# Altium schematic sheet LEDs.SchDoc
size A4; SheetNumber: 3; SheetTotal: 11; SPICEModelCachePAYDFKMG: <root> / <DocumentId>PAYDFKMG</DocumentId> / <CacheFrame Number="0"> / <Model Name="0603_150060bs75000" Kind="CKT"> / <Text>****** / .subckt 0603_150060BS75000  1  2 / D1 1 2 SMCW / .MODEL SMCW D / + IS=316.72E-15 / + N=3.9746 / + RS=1.2476 / + IKF=130.15E-6 / + CJO=1.0000E-12 / + M=.3333 / + VJ=.75 / + BV=5 / + IBV=10.00E-6 / + TT=5.0000E-9 / .ends</Text> / </Model> / <Model Name="0603_150060ys75000" Kind="CKT"> / <Text>****** / .subckt 0603_150060YS75000  1  2 / D1 1 2 SMCW / .MODEL SMCW D / + IS=10.010E-21 / + N=1.8441 / + RS=1.0000E-6 / + IKF=1.0000E3 / + CJO=1.0000E-12 / + M=.3333 / + VJ=.75 / + BV=5 / + IBV=10.00E-6 / + TT=5.0000E-9 / .ends</Text> / </Model> / <Model Name="0603_150060as75000" Kind="CKT"> / <Text>************************************************** / * Manufacturer:           Wurth Elektronik / * Kinds:                  SMT Mono-color Chip LED Waterclear / * Matchcode:              WL-SMCW / * Library Type:           LTspice / * Version:                rev22a / * Created/modified by:    Ella / * Date and Time:          2022-02-18 / * Team:                   eiSos EDA Service / * Contact:                libraries@we-online.com / ************************************************** / * Copyright(C) 2022 WÃ¼rth Elektronik eiSos GmbH &amp; Co. KG / * All Rights Reserved. / ************************************************** / * Disclaimer: While WÃ¼rth Elektronik eiSos has made every reasonable effort to ensure the accuracy / * of the simulation models provided, WÃ¼rth Elektronik eiSos does not guarantee the exemption of error on / * the simulation models, nor does WÃ¼rth Elektronik eiSos guarantee that the simulation model is current. / * WÃ¼rth Elektronik eiSos reserves the right to make any adjustments at any time without notice. / * WÃ¼rth Elektronik eiSos expressly disclaims all implied warranties regarding this simulation model. / ************************************************** / .subckt 0603_150060AS75000  1  2 / D1 1 2 SMCW / .MODEL SMCW D / + IS=10.010E-21 / + N=1.8643 / + RS=1.0000E-6 / + IKF=999 / + CJO=1.0000E-12 / + M=.3333 / + VJ=.75 / + BV=100 / + TT=5.0000E-9 / .ends</Text> / </Model> / <Model Name="0603_150060rs75000" Kind="CKT"> / <Text>****** / .subckt 0603_150060RS75000  1  2 / D1 1 2 SMCW / .MODEL SMCW D / + IS=39.260E-18 / + N=2.2264 / + RS=1.0000E-6 / + IKF=.13281 / + CJO=1.0000E-12 / + M=.3333 / + VJ=.75 / + BV=100 / + IBV=10.00E-6 / + TT=5.0000E-9 / .ends</Text> / </Model> / </CacheFrame> / </root>
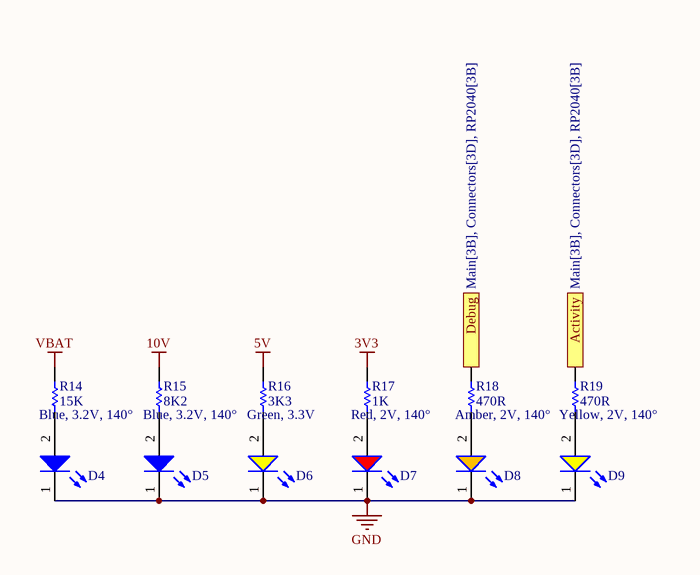
[diagram p0: LEDs.SchDoc]

## Parts
D4  Blue, 3.2V, 140°  [WL-SMCW_0603_150060xx75000]
D5  Blue, 3.2V, 140°  [WL-SMCW_0603_150060xx75000]
D6  Green, 3.3V  [WL-SMCW_0603_150060xx75000]
D7  Red, 2V, 140°  [WL-SMCW_0603_150060xx75000]
D8  Amber, 2V, 140°  [WL-SMCW_0603_150060xx75000]
D9  Yellow, 2V, 140°  [WL-SMCW_0603_150060xx75000]
R14  15K  [0402 resistor]
R15  8K2  [0402 resistor]
R16  3K3  [0402 resistor]
R17  1K  [0402 resistor]
R18  470R  [0402 resistor]
R19  470R  [0402 resistor]

## Ports
Activity (see Main[3B], Connectors[3D], RP2040[3B]), Debug (see Main[3B], Connectors[3D], RP2040[3B])

## Nets
3V3: R17.2
5V: R16.2
10V: R15.2
GND: D4.1(K) D5.1(K) D6.1(K) D7.1(K) D8.1(K) D9.1(K)
VBAT: R14.2
Activity: R19.2 ; port Activity
Debug: R18.2 ; port Debug
NetD4_2: D4.2(A) R14.1
NetD5_2: D5.2(A) R15.1
NetD6_2: D6.2(A) R16.1
NetD7_2: D7.2(A) R17.1
NetD8_2: D8.2(A) R18.1
NetD9_2: D9.2(A) R19.1

## Library data of the parts
D4 D5 = 150060BS75000: WL-SMCW Mono-color Chip LED Waterclear, size 0603, Blue, 3.2V, 140°; Manufacturer: Wurth Elektronik; Case/Size Code: 0603; Chip Technology: InGaN; Dominant Wavelength: 470nm; Luminous Intensity: 145mcd; Peak Wavelength: 465nm; Manufacturer Part Number: 150060BS75000; Category: Signal LEDs; Match Code: WL-SMCW; ComponentLink1Description: Website Link; ComponentLink1URL: https://www.we-online.com/redexpert/article/150060BS75000?ad; ComponentLink2Description: Datasheet Link; ComponentLink2URL: https://www.we-online.com/redexpert/spec/150060BS75000?ad; Mount: Surface Mount; Operating Temperature Max: 85°C; Operating Temperature Min: -40°C; Packaging: Tape and Reel; Length: 1.6mm; Width: 0.8mm; Height: 0.7mm; Emitting Color: Blue; Forward Voltage: 3.2V; Viewing Angle: 140°
D6 D9 = 150060YS75000: WL-SMCW Mono-color Chip LED Waterclear, size 0603, Yellow, 2V, 140°; Manufacturer: Wurth Elektronik; Case/Size Code: 0603; Chip Technology: AlInGaP; Dominant Wavelength: 590nm; Luminous Intensity: 120mcd; Peak Wavelength: 595nm; Manufacturer Part Number: 150060YS75000; Category: Signal LEDs; Match Code: WL-SMCW; ComponentLink1Description: Website Link; ComponentLink1URL: https://www.we-online.com/redexpert/article/150060YS75000?ad; ComponentLink2Description: Datasheet Link; ComponentLink2URL: https://www.we-online.com/redexpert/spec/150060YS75000?ad; Mount: Surface Mount; Operating Temperature Max: 85°C; Operating Temperature Min: -40°C; Packaging: Tape and Reel; Length: 1.6mm; Width: 0.8mm; Height: 0.7mm; Emitting Color: Yellow; Forward Voltage: 2V; Viewing Angle: 140°
D7 = 150060RS75000: WL-SMCW Mono-color Chip LED Waterclear, size 0603, Red, 2V, 140°; Manufacturer: Wurth Elektronik; Case/Size Code: 0603; Chip Technology: AlInGaP; Dominant Wavelength: 625nm; Luminous Intensity: 250mcd; Peak Wavelength: 630nm; Manufacturer Part Number: 150060RS75000; Category: Signal LEDs; Match Code: WL-SMCW; ComponentLink1Description: Website Link; ComponentLink1URL: https://www.we-online.com/redexpert/article/150060RS75000?ad; ComponentLink2Description: Datasheet Link; ComponentLink2URL: https://www.we-online.com/redexpert/spec/150060RS75000?ad; Mount: Surface Mount; Operating Temperature Max: 85°C; Operating Temperature Min: -40°C; Packaging: Tape and Reel; Length: 1.6mm; Width: 0.8mm; Height: 0.7mm; Emitting Color: Red; Forward Voltage: 2V; Viewing Angle: 140°
D8 = 150060AS75000: WL-SMCW Mono-color Chip LED Waterclear, size 0603, Amber, 2V, 140°; Manufacturer: Wurth Elektronik; Case/Size Code: 0603; Chip Technology: AlInGaP; Dominant Wavelength: 605nm; Luminous Intensity: 130mcd; Peak Wavelength: 610nm; Manufacturer Part Number: 150060AS75000; Category: Signal LEDs; Match Code: WL-SMCW; ComponentLink1Description: Website Link; ComponentLink1URL: https://www.we-online.com/redexpert/article/150060AS75000?ad; ComponentLink2Description: Datasheet Link; ComponentLink2URL: https://www.we-online.com/redexpert/spec/150060AS75000?ad; Mount: Surface Mount; Operating Temperature Max: 85°C; Operating Temperature Min: -40°C; Packaging: Tape and Reel; Length: 1.6mm; Width: 0.8mm; Height: 0.7mm; Emitting Color: Amber; Forward Voltage: 2V; Viewing Angle: 140°
R14-R19 = Resistor 0402 1K
  R14: Value: 15K
  R15: Value: 8K2
  R16: Value: 3K3
  R17: Value: 1K
  R18 R19: Value: 470R